# Altium schematic sheet 19_KEY_M_X4.SchDoc: C200
size 439 x 311 mm; Page Create Date: March  8, 1995; Page Number: 19; Page Size: Custom; Comment: radxa_1010; Page Count: 21; RevCode: V1.11; Doc: 19_KEY_M_X4; DsnPath: D:\WMS\C200\CC122\对外\C200 V1.11.DSN; SchematicName: c200; PageName: 19_KEY_M_X4; PageSize: Custom; TopSchematic: True
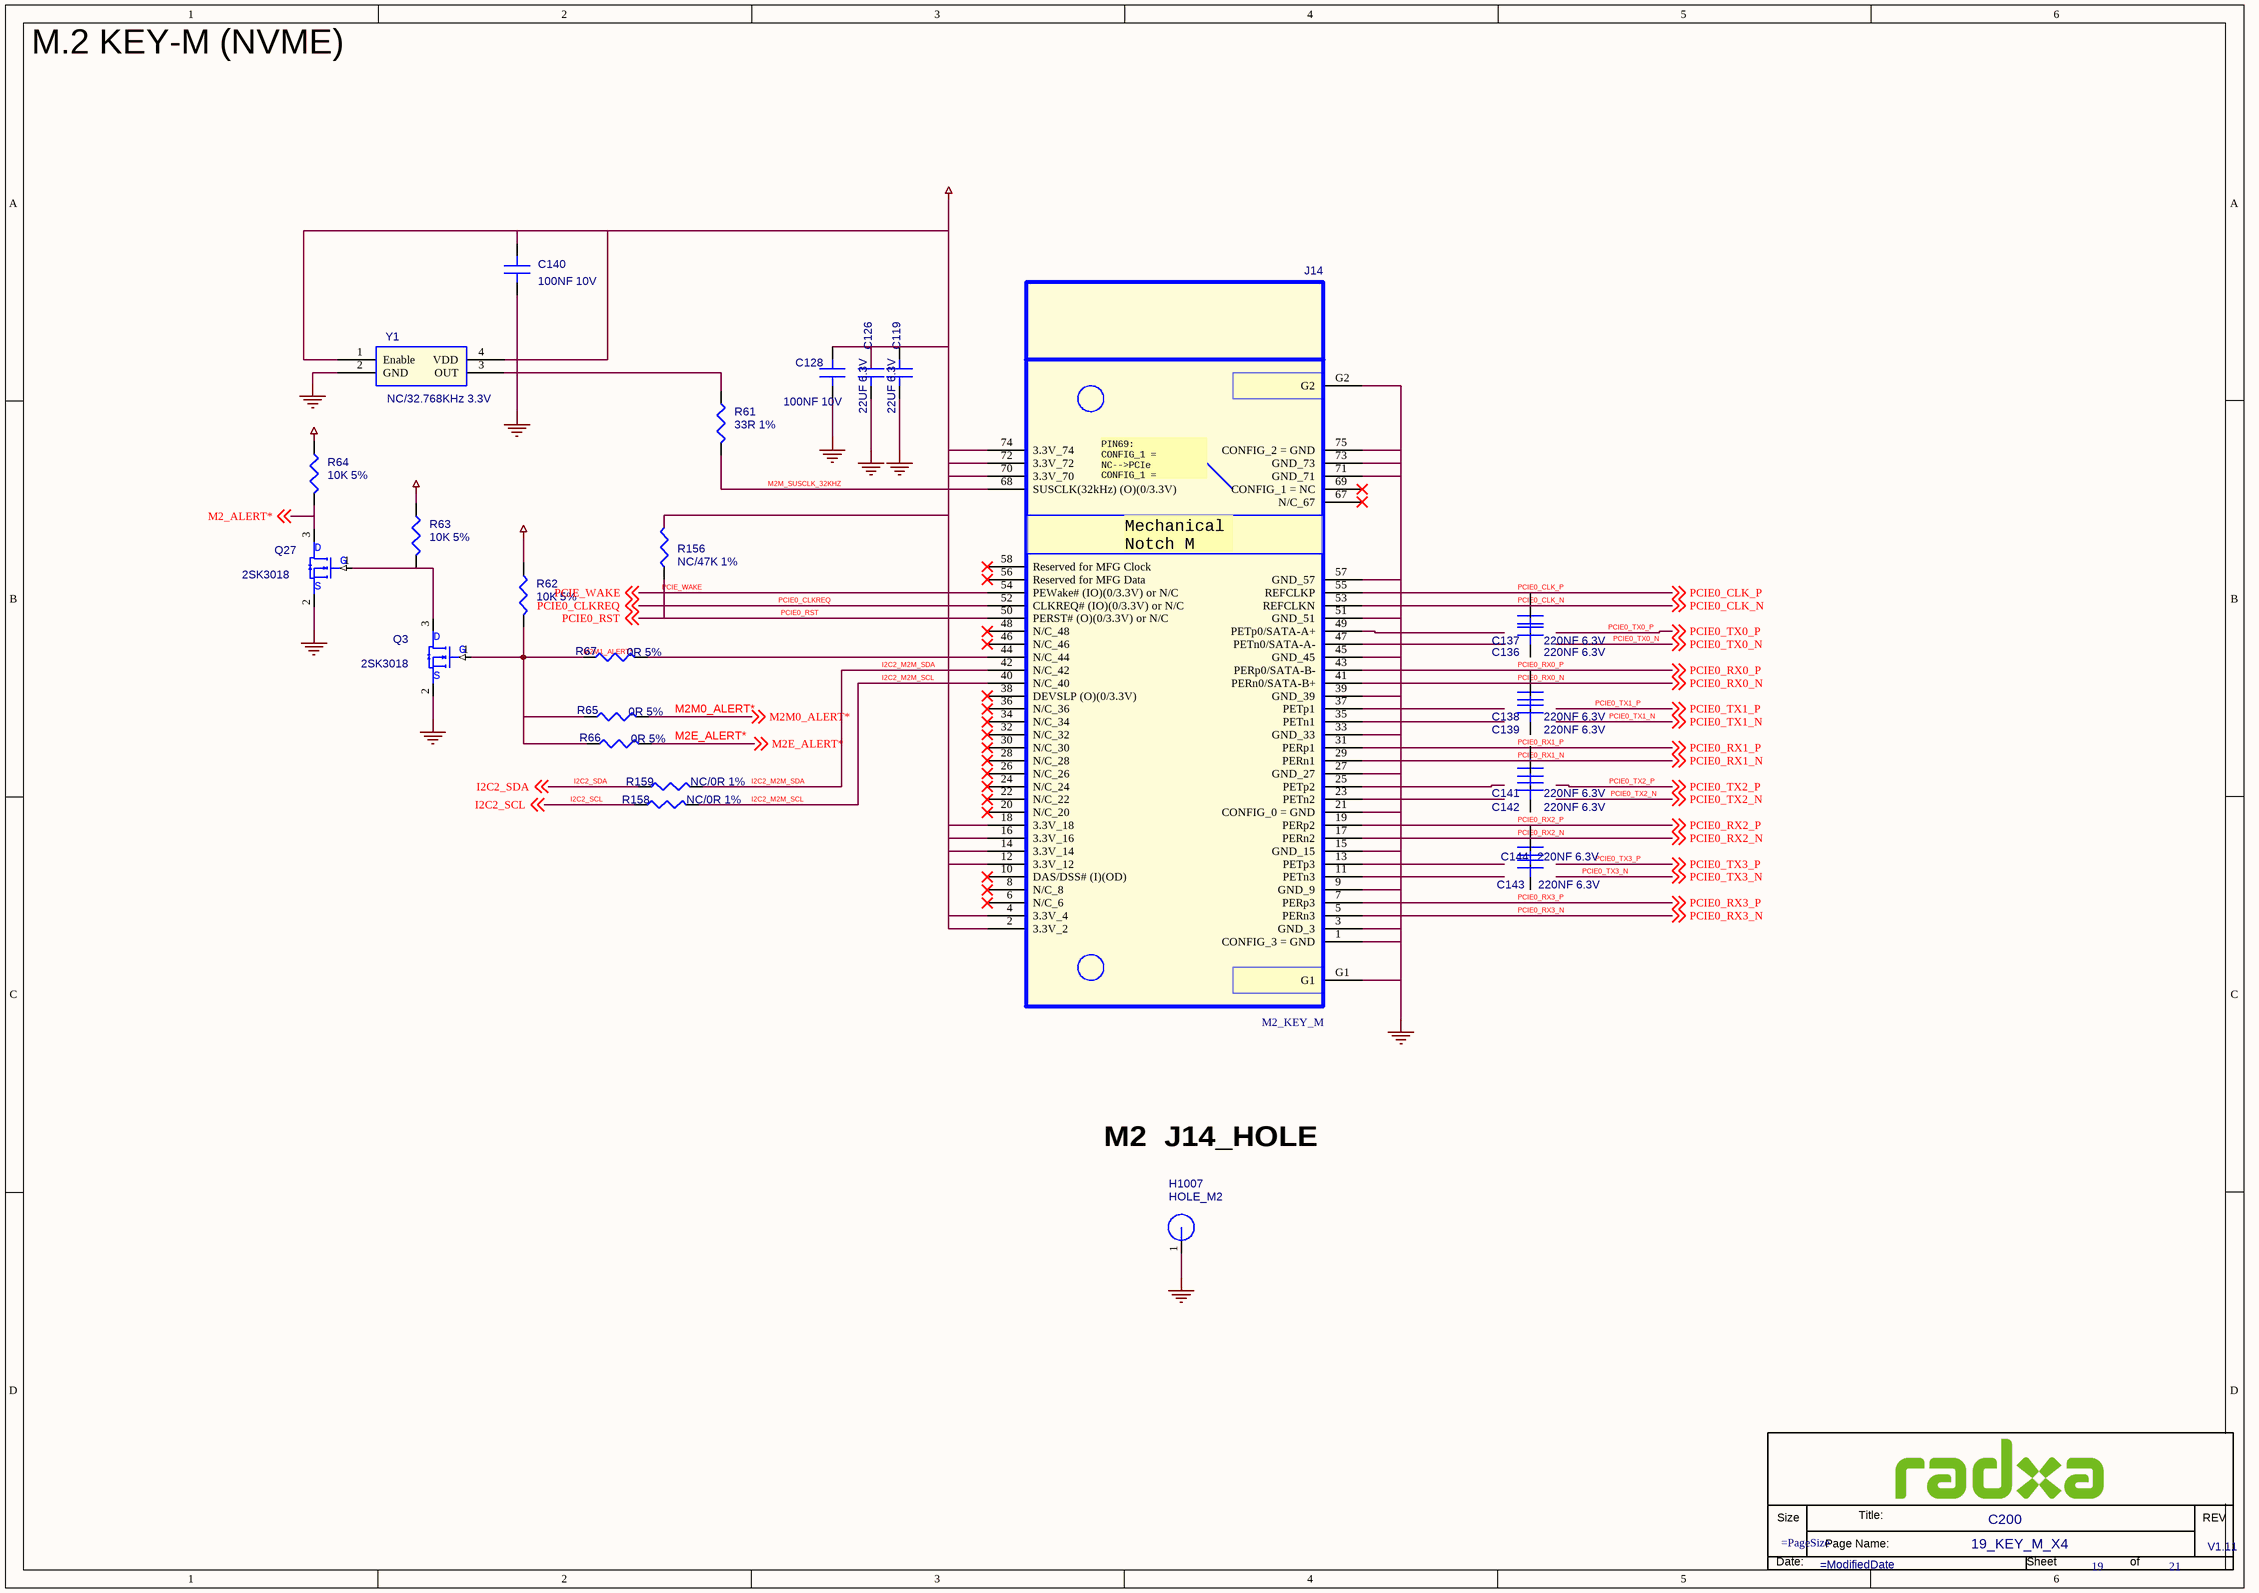
[diagram p0: 19_KEY_M_X4.SchDoc]

## Parts
*  Doc: 19_KEY_M_X4  RevCode: V1.11  Title: C200  Page Number: 19  Page Count: 21  (hidden comment: radxa_1010)  (graphical)
C119  22UF 6.3V  [C0603]
C126  22UF 6.3V  [C0603]
C128  100NF 10V  [C0402]
C136  220NF 6.3V  [C0201]
C137  220NF 6.3V  [C0201]
C138  220NF 6.3V  [C0201]
C139  220NF 6.3V  [C0201]
C140  100NF 10V  [C0402]
C141  220NF 6.3V  [C0201]
C142  220NF 6.3V  [C0201]
C143  220NF 6.3V  [C0201]
C144  220NF 6.3V  [C0201]
H1007  HOLE_M2  [H3.8MM]
J14  M2_KEY_M  [M2-M_KEY_SM_75_0D5]
Q3  2SK3018  [SOT_323]
Q27  2SK3018  [SOT_323]
R61  33R 1%  [R0402]
R62  10K 5%  [R0402]
R63  10K 5%  [R0402]
R64  10K 5%  [R0402]
R65  0R 5%  [R0402]
R66  0R 5%  [R0402]
R67  0R 5%  [R0402]
R156  NC/47K 1%  [R0402]
R158  NC/0R 1%  [R0402]
R159  NC/0R 1%  [R0402]
Y1  NC/32.768KHz 3.3V  [Y-4-5_08-TXC-7W5]

## Nets
GND: C119.2(B) C126.2(B) C128.2(B) C140.2(B) H1007.1 J14.1(CONFIG_3_=_GND) J14.3(GND_3) J14.9(GND_9) J14.15(GND_15) J14.21(CONFIG_0_=_GND) J14.27(GND_27) J14.33(GND_33) J14.39(GND_39) J14.45(GND_45) J14.51(GND_51) J14.57(GND_57) J14.71(GND_71) J14.73(GND_73) J14.75(CONFIG_2_=_GND) J14.G1 J14.G2 Q3.2(S) Q27.2(S) Y1.2(GND)
MKEY_3V3: C119.1(A) C126.1(A) C128.1(A) C140.1(A) J14.2(3.3V_2) J14.4(3.3V_4) J14.12(3.3V_12) J14.14(3.3V_14) J14.16(3.3V_16) J14.18(3.3V_18) J14.70(3.3V_70) J14.72(3.3V_72) J14.74(3.3V_74) R156.1 Y1.1(Enable) Y1.4(VDD)
VDD_1V8: R62.1 R63.1 R64.1
I2C2_M2M_SCL: J14.40(N/C_40) R158.2
I2C2_M2M_SDA: J14.42(N/C_42) R159.2
I2C2_SCL: R158.1 ; off-sheet I2C2_SCL
I2C2_SDA: R159.1 ; off-sheet I2C2_SDA
M2_ALERT*: Q27.3(D) R64.2 ; off-sheet M2_ALERT*
M2E_ALERT*: R66.2 ; off-sheet M2E_ALERT*
M2M0_ALERT*: R65.2 ; off-sheet M2M0_ALERT*
M2M1_ALERT*: Q3.1(G) R62.2 R65.1 R66.1 R67.1
M2M_SUSCLK_32KHZ: J14.68(SUSCLK(32kHz)_(O)(0/3.3V)) R61.2
PCIE0_CLK_N: C136.1(A) J14.53(REFCLKN) ; off-sheet PCIE0_CLK_N
PCIE0_CLK_P: J14.55(REFCLKP) ; off-sheet PCIE0_CLK_P
PCIE0_CLKREQ: J14.52(CLKREQ#_(IO)(0/3.3V)_or_N/C) ; off-sheet PCIE0_CLKREQ
PCIE0_RST: J14.50(PERST#_(O)(0/3.3V)_or_N/C) R156.2 ; off-sheet PCIE0_RST
PCIE0_RX0_N: C139.1(A) J14.41(PERn0/SATA-B+) ; off-sheet PCIE0_RX0_N
PCIE0_RX0_P: C138.1(A) J14.43(PERp0/SATA-B-) ; off-sheet PCIE0_RX0_P
PCIE0_RX1_N: C142.1(A) J14.29(PERn1) ; off-sheet PCIE0_RX1_N
PCIE0_RX1_P: J14.31(PERp1) ; off-sheet PCIE0_RX1_P
PCIE0_RX2_N: C143.1(A) J14.17(PERn2) ; off-sheet PCIE0_RX2_N
PCIE0_RX2_P: C144.1(A) J14.19(PERp2) ; off-sheet PCIE0_RX2_P
PCIE0_RX3_N: J14.5(PERn3) ; off-sheet PCIE0_RX3_N
PCIE0_RX3_P: J14.7(PERp3) ; off-sheet PCIE0_RX3_P
PCIE_WAKE: J14.54(PEWake#_(IO)(0/3.3V)_or_N/C) ; off-sheet PCIE_WAKE
NetJ14_44: J14.44(N/C_44) R67.2
NetQ3_3: Q3.3(D) Q27.1(G) R63.2
NetR61_1: R61.1 Y1.3(OUT)

Not connected (* = marked no-connect by the designer): C136 2(B); C137 1(A) 2(B); C138 2(B); C139 2(B); C141 1(A) 2(B); C142 2(B); C143 2(B); C144 2(B); J14 6(N/C_6)* 8(N/C_8)* 10(DAS/DSS#_(I)(OD))* 11(PETn3) 13(PETp3) 20(N/C_20)* 22(N/C_22)* 23(PETn2) 24(N/C_24)* 25(PETp2) 26(N/C_26)* 28(N/C_28)* 30(N/C_30)* 32(N/C_32)* 34(N/C_34)* 35(PETn1) 36(N/C_36)* 37(PETp1) 38(DEVSLP_(O)(0/3.3V))* 46(N/C_46)* 47(PETn0/SATA-A-) 48(N/C_48)* 49(PETp0/SATA-A+) 56(Reserved_for_MFG_Data)* 58(Reserved_for_MFG_Clock)* 67(N/C_67)* 69(CONFIG_1_=_NC)*

## Notes on the sheet
- M.2 KEY-M (NVME)
- M2  J14_HOLE
- (in symbol M2_KEY_M) PIN69: / CONFIG_1 = NC-->PCIe / CONFIG_1 = / GND-->SATA; Mechanical / Notch M
- (in symbol radxa_1010) Size; Title:; REV; Page Name:; Date:; Sheet; of

## Library data of the parts
C119 = C: SMD  0603  22UF  6.3V  X5R  ±20%  ROHS; PARTS: 1; Part Reference: C119; Part Number: A1C01.00004; OriginalSymbolOrigin: (0,30); PKG_TYPE: CAP2-100-250; LEVEL: STD; PINSWAP: (A,B); Value: 22UF 6.3V; Part Type: 陶瓷电容; PCB Footprint: C0603
C126 = C: SMD  0603  22UF  6.3V  X5R  ±20%  ROHS; PARTS: 1; Part Reference: C126; Part Number: A1C01.00004; OriginalSymbolOrigin: (0,30); PKG_TYPE: CAP2-100-250; LEVEL: STD; PINSWAP: (A,B); Value: 22UF 6.3V; Part Type: 陶瓷电容; PCB Footprint: C0603
C128 = C: SMD  0402  100NF  10V  X5R  ±10%  ROHS; PARTS: 1; Part Reference: C128; Part Number: A1C01.00163; OriginalSymbolOrigin: (0,30); PKG_TYPE: CAP2-100-250; LEVEL: STD; PINSWAP: (A,B); Value: 100NF 10V; Part Type: 陶瓷电容; PCB Footprint: C0402
C136 = C: SMD  0201  220NF  6.3V  X5R  ±20%  ROHS; PARTS: 1; Part Reference: C136; CDS_PART_NAME: C_0402-0.22UF,X5R,10%,6.3V,039-0011-000; CDS_PHYS_PART_NAME: C_0402-0.22UF,X5R,10%,6.3V,039-0011-000-0.22UF,039-0011-000; Part Number: A1C01.00128; OriginalSymbolOrigin: (0,30); PKG_TYPE: CAP2-100-250; LEVEL: STD; PINSWAP: (A,B); ASSEMBLY: M2_NVME; CDS_LIB: discrete; DEVICE_TYPENAME: C_0402-022UFX5R1063V039-0011-000-022UF039-0011-000; DRAWING: #NAME?; NV_PN: 039-0011-000; PACK_TYPE: 402; PATH: I8; PHYS_PAGE: 21; ROT: 0; SIGNAL_MODEL: nv_cap; TOL: 10%; VER: 2; XY: (-2700,4250); Value: 220NF 6.3V; CDS_SEC: 1; CHIPS_PART_NAME: C; MAT: X5R; MAX_VOLTAGE: 6.3V; SEC: 1; Part Type: 陶瓷电容; PCB Footprint: C0201
C137 = C: SMD  0201  220NF  6.3V  X5R  ±20%  ROHS; PARTS: 1; Part Reference: C137; Part Number: A1C01.00128; CDS_PHYS_PART_NAME: C_0402-0.22UF,X5R,10%,6.3V,039-0011-000-0.22UF,039-0011-000; CDS_PART_NAME: C_0402-0.22UF,X5R,10%,6.3V,039-0011-000; OriginalSymbolOrigin: (0,30); PKG_TYPE: CAP2-100-250; LEVEL: STD; PINSWAP: (A,B); XY: (-3150,4300); VER: 2; TOL: 10%; SIGNAL_MODEL: nv_cap; ROT: 0; PHYS_PAGE: 21; PATH: I24; PACK_TYPE: 402; NV_PN: 039-0011-000; DRAWING: #NAME?; DEVICE_TYPENAME: C_0402-022UFX5R1063V039-0011-000-022UF039-0011-000; CDS_LIB: discrete; ASSEMBLY: M2_NVME; Value: 220NF 6.3V; Part Type: 陶瓷电容; SEC: 1; MAX_VOLTAGE: 6.3V; MAT: X5R; CHIPS_PART_NAME: C; CDS_SEC: 1; PCB Footprint: C0201
C138 = C: SMD  0201  220NF  6.3V  X5R  ±20%  ROHS; PARTS: 1; Part Reference: C138; Part Number: A1C01.00128; CDS_PHYS_PART_NAME: C_0402-0.22UF,X5R,10%,6.3V,039-0011-000-0.22UF,039-0011-000; CDS_PART_NAME: C_0402-0.22UF,X5R,10%,6.3V,039-0011-000; OriginalSymbolOrigin: (0,30); PKG_TYPE: CAP2-100-250; LEVEL: STD; PINSWAP: (A,B); XY: (-3150,4000); VER: 2; TOL: 10%; SIGNAL_MODEL: nv_cap; ROT: 0; PHYS_PAGE: 21; PATH: I32; PACK_TYPE: 402; NV_PN: 039-0011-000; DRAWING: #NAME?; DEVICE_TYPENAME: C_0402-022UFX5R1063V039-0011-000-022UF039-0011-000; CDS_LIB: discrete; ASSEMBLY: M2_NVME; Value: 220NF 6.3V; Part Type: 陶瓷电容; SEC: 1; MAX_VOLTAGE: 6.3V; MAT: X5R; CHIPS_PART_NAME: C; CDS_SEC: 1; PCB Footprint: C0201
C139 = C: SMD  0201  220NF  6.3V  X5R  ±20%  ROHS; PARTS: 1; Part Reference: C139; CDS_PART_NAME: C_0402-0.22UF,X5R,10%,6.3V,039-0011-000; CDS_PHYS_PART_NAME: C_0402-0.22UF,X5R,10%,6.3V,039-0011-000-0.22UF,039-0011-000; Part Number: A1C01.00128; OriginalSymbolOrigin: (0,30); PKG_TYPE: CAP2-100-250; LEVEL: STD; PINSWAP: (A,B); ASSEMBLY: M2_NVME; CDS_LIB: discrete; DEVICE_TYPENAME: C_0402-022UFX5R1063V039-0011-000-022UF039-0011-000; DRAWING: #NAME?; NV_PN: 039-0011-000; PACK_TYPE: 402; PATH: I21; PHYS_PAGE: 21; ROT: 0; SIGNAL_MODEL: nv_cap; TOL: 10%; VER: 2; XY: (-2700,3950); Value: 220NF 6.3V; CDS_SEC: 1; CHIPS_PART_NAME: C; MAT: X5R; MAX_VOLTAGE: 6.3V; SEC: 1; Part Type: 陶瓷电容; PCB Footprint: C0201
C140 = C: SMD  0402  100NF  10V  X5R  ±10%  ROHS; PARTS: 1; Part Reference: C140; Part Number: A1C01.00163; OriginalSymbolOrigin: (0,30); PKG_TYPE: CAP2-100-250; LEVEL: STD; PINSWAP: (A,B); Value: 100NF 10V; Part Type: 陶瓷电容; PCB Footprint: C0402
C141 = C: SMD  0201  220NF  6.3V  X5R  ±20%  ROHS; PARTS: 1; Part Reference: C141; Part Number: A1C01.00128; CDS_PHYS_PART_NAME: C_0402-0.22UF,X5R,10%,6.3V,039-0011-000-0.22UF,039-0011-000; CDS_PART_NAME: C_0402-0.22UF,X5R,10%,6.3V,039-0011-000; OriginalSymbolOrigin: (0,30); PKG_TYPE: CAP2-100-250; LEVEL: STD; PINSWAP: (A,B); XY: (-3150,3700); VER: 2; TOL: 10%; SIGNAL_MODEL: nv_cap; ROT: 0; PHYS_PAGE: 21; PATH: I30; PACK_TYPE: 402; NV_PN: 039-0011-000; DRAWING: #NAME?; DEVICE_TYPENAME: C_0402-022UFX5R1063V039-0011-000-022UF039-0011-000; CDS_LIB: discrete; ASSEMBLY: M2_NVME; Value: 220NF 6.3V; Part Type: 陶瓷电容; SEC: 1; MAX_VOLTAGE: 6.3V; MAT: X5R; CHIPS_PART_NAME: C; CDS_SEC: 1; PCB Footprint: C0201
C142 = C: SMD  0201  220NF  6.3V  X5R  ±20%  ROHS; PARTS: 1; Part Reference: C142; CDS_PART_NAME: C_0402-0.22UF,X5R,10%,6.3V,039-0011-000; CDS_PHYS_PART_NAME: C_0402-0.22UF,X5R,10%,6.3V,039-0011-000-0.22UF,039-0011-000; Part Number: A1C01.00128; OriginalSymbolOrigin: (0,30); PKG_TYPE: CAP2-100-250; LEVEL: STD; PINSWAP: (A,B); ASSEMBLY: M2_NVME; CDS_LIB: discrete; DEVICE_TYPENAME: C_0402-022UFX5R1063V039-0011-000-022UF039-0011-000; DRAWING: #NAME?; NV_PN: 039-0011-000; PACK_TYPE: 402; PATH: I22; PHYS_PAGE: 21; ROT: 0; SIGNAL_MODEL: nv_cap; TOL: 10%; VER: 2; XY: (-2700,3650); Value: 220NF 6.3V; CDS_SEC: 1; CHIPS_PART_NAME: C; MAT: X5R; MAX_VOLTAGE: 6.3V; SEC: 1; Part Type: 陶瓷电容; PCB Footprint: C0201
C143 = C: SMD  0201  220NF  6.3V  X5R  ±20%  ROHS; PARTS: 1; Part Reference: C143; Part Number: A1C01.00128; CDS_PHYS_PART_NAME: C_0402-0.22UF,X5R,10%,6.3V,039-0011-000-0.22UF,039-0011-000; CDS_PART_NAME: C_0402-0.22UF,X5R,10%,6.3V,039-0011-000; OriginalSymbolOrigin: (0,30); PKG_TYPE: CAP2-100-250; LEVEL: STD; PINSWAP: (A,B); XY: (-2700,3350); VER: 2; TOL: 10%; SIGNAL_MODEL: nv_cap; ROT: 0; PHYS_PAGE: 21; PATH: I23; PACK_TYPE: 402; NV_PN: 039-0011-000; DRAWING: #NAME?; DEVICE_TYPENAME: C_0402-022UFX5R1063V039-0011-000-022UF039-0011-000; CDS_LIB: discrete; ASSEMBLY: M2_NVME; Value: 220NF 6.3V; Part Type: 陶瓷电容; SEC: 1; MAX_VOLTAGE: 6.3V; MAT: X5R; CHIPS_PART_NAME: C; CDS_SEC: 1; PCB Footprint: C0201
C144 = C: SMD  0201  220NF  6.3V  X5R  ±20%  ROHS; PARTS: 1; Part Reference: C144; Part Number: A1C01.00128; CDS_PHYS_PART_NAME: C_0402-0.22UF,X5R,10%,6.3V,039-0011-000-0.22UF,039-0011-000; CDS_PART_NAME: C_0402-0.22UF,X5R,10%,6.3V,039-0011-000; OriginalSymbolOrigin: (0,30); PKG_TYPE: CAP2-100-250; LEVEL: STD; PINSWAP: (A,B); XY: (-3150,3400); VER: 2; TOL: 10%; SIGNAL_MODEL: nv_cap; ROT: 0; PHYS_PAGE: 21; PATH: I31; PACK_TYPE: 402; NV_PN: 039-0011-000; DRAWING: #NAME?; DEVICE_TYPENAME: C_0402-022UFX5R1063V039-0011-000-022UF039-0011-000; CDS_LIB: discrete; ASSEMBLY: M2_NVME; Value: 220NF 6.3V; Part Type: 陶瓷电容; SEC: 1; MAX_VOLTAGE: 6.3V; MAT: X5R; CHIPS_PART_NAME: C; CDS_SEC: 1; PCB Footprint: C0201
H1007 = HOLE: Part Reference: H1007; PCB Footprint: HOLE_2D7_6D0_A; Priority: A; RK PN: HOLE_3R50; Value: HOLE_M2; Part Type: HOLE
J14 = M2_KEY_M: SMD  母座  75PIN  180度  M.2  M KEY  H4.2  0.5mm脚距  APC10359-P001A  黑色  LOTES  ROHS; Part Reference: J14; Part Number: A1J01.00017; Parameter: 连接器-比派-封装 M2_KEY_M; Value: M2_KEY_M; Part Type: 连接座; PCB Footprint: M2-M_KEY_SM_75_0D5
Q3 = MOSFET_NPN: SMD  编带  SOT-323  2SK3018  N沟道  长晶  ROHS; Part Reference: Q3; Part Number: A1D01.00007; Temp Coeff: -55℃ to ＋150℃; Value: 2SK3018; Part Type: 三极管-MOS管; PCB Footprint: SOT_323
Q27 = MOSFET_NPN: SMD  编带  SOT-323  2SK3018  N沟道  长晶  ROHS; Part Reference: Q27; Part Number: A1D01.00007; Temp Coeff: -55℃ to ＋150℃; Value: 2SK3018; Part Type: 三极管-MOS管; PCB Footprint: SOT_323
R61 = R: SMD  0201  33R  1/20W  ±1%  ROHS; Part Reference: R61; Part Number: A1R01.00137; PCB Footprint: R0201; Value: 33R 1%; Part Type: 贴片电阻
R62 = R: SMD  0201  10K  1/20W  ±5%  ROHS; Part Reference: R62; Part Number: A1R01.00012; PCB Footprint: R0201; Temp Coeff: －55℃ ~ ＋125℃; Value: 10K 5%; Part Type: 贴片电阻
R63 = R: SMD  0201  10K  1/20W  ±5%  ROHS; Part Reference: R63; Part Number: A1R01.00012; PCB Footprint: R0201; Temp Coeff: －55℃ ~ ＋125℃; Value: 10K 5%; Part Type: 贴片电阻
R64 = R: SMD  0201  10K  1/20W  ±5%  ROHS; Part Reference: R64; Part Number: A1R01.00012; PCB Footprint: R0201; Temp Coeff: －55℃ ~ ＋125℃; Value: 10K 5%; Part Type: 贴片电阻
R65 = R: SMD  0201  0R  1/20W  ±5%  ROHS; Part Reference: R65; Part Number: A1R01.00027; PCB Footprint: R0201; Temp Coeff: －55℃ ~ ＋125℃; Value: 0R 5%; Part Type: 贴片电阻
R66 = R: SMD  0201  0R  1/20W  ±5%  ROHS; Part Reference: R66; Part Number: A1R01.00027; PCB Footprint: R0201; Temp Coeff: －55℃ ~ ＋125℃; Value: 0R 5%; Part Type: 贴片电阻
R67 = R: SMD  0201  0R  1/20W  ±5%  ROHS; Part Reference: R67; Part Number: A1R01.00027; PCB Footprint: R0201; Temp Coeff: －55℃ ~ ＋125℃; Value: 0R 5%; Part Type: 贴片电阻
R156 = R: SMD  0402  47K  1/16W  ±1%  ROHS; Part Reference: R156; Part Number: A1R01.00248; CDS_PART_NAME: R_0402-47K,5 %,62.5MW,195-0599-000; CDS_PHYS_PART_NAME: R_0402-47K,5 %,62.5MW,195-0599-000-195-0599-000,47K; ASSEMBLY: M2_NVME; CDS_LIB: discrete; CDS_SEC: 1; DEVICE_TYPENAME: R_0402-47K5625MW195-0599-000-195-0599-00047K; DRAWING: #NAME?; MAX_WATTAGE: 62.5mW; NV_PN: 195-0599-000; PACK_TYPE: 402; PATH: I39; PHYS_PAGE: 21; ROT: 2; SIGNAL_MODEL: nv_res; TOL: 5%; XY: (-8000,4600); PCB Footprint: R0402; Value: NC/47K 1%; Part Type: 贴片电阻; CHIPS_PART_NAME: R; SKU: NO STUFF; VER: 2; SEC: 1
R158 = R: SMD  0402  0R  1/16W  ±1%  ROHS; Part Reference: R158; Part Number: A1R01.00219; PCB Footprint: R0402; Value: NC/0R 1%; Part Type: 贴片电阻
R159 = R: SMD  0402  0R  1/16W  ±1%  ROHS; Part Reference: R159; Part Number: A1R01.00219; PCB Footprint: R0402; Value: NC/0R 1%; Part Type: 贴片电阻
Y1 = OSC_4P_V: SMD  编带  有源  3225  32.768KHz  3.3V  ±10ppm  ROHS; Part Reference: Y1; Part Number: A1Y01.00030; PCB Footprint: OSC_SM4_3D2X2D5; Value: NC/32.768KHz 3.3V; Part Type: 晶振
* = radxa_1010: Page Create Date: March  8, 1995; Page Size: =PageSize; Page Modify Date: =ModifiedDate